# EAGLE schematic untitled (EAGLE 9.1.0)
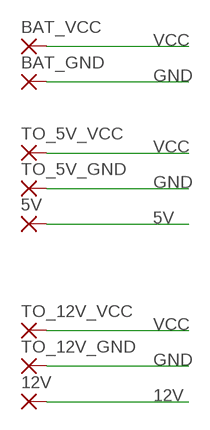
[diagram p0: schematic, sheet 1]

## Parts
5V  3,81/1,4  [3,81/1,4]
12V  3,81/1,4  [3,81/1,4]
BAT_GND  3,81/1,4  [3,81/1,4]
BAT_VCC  3,81/1,4  [3,81/1,4]
TO_5V_GND  3,81/1,4  [3,81/1,4]
TO_5V_VCC  3,81/1,4  [3,81/1,4]
TO_12V_GND  3,81/1,4  [3,81/1,4]
TO_12V_VCC  3,81/1,4  [3,81/1,4]

## Nets
5V: 5V.1(P)
12V: 12V.1(P)
GND: BAT_GND.1(P) TO_5V_GND.1(P) TO_12V_GND.1(P)
VCC: BAT_VCC.1(P) TO_5V_VCC.1(P) TO_12V_VCC.1(P)

## Library data of the parts
5V 12V BAT_GND BAT_VCC TO_5V_GND TO_5V_VCC TO_12V_GND TO_12V_VCC = wirepad:3,81/1,4: THROUGH-HOLE PAD